# Altium schematic sheet MainSheet.SchDoc
size A; SheetNumber: 2; SheetTotal: 2
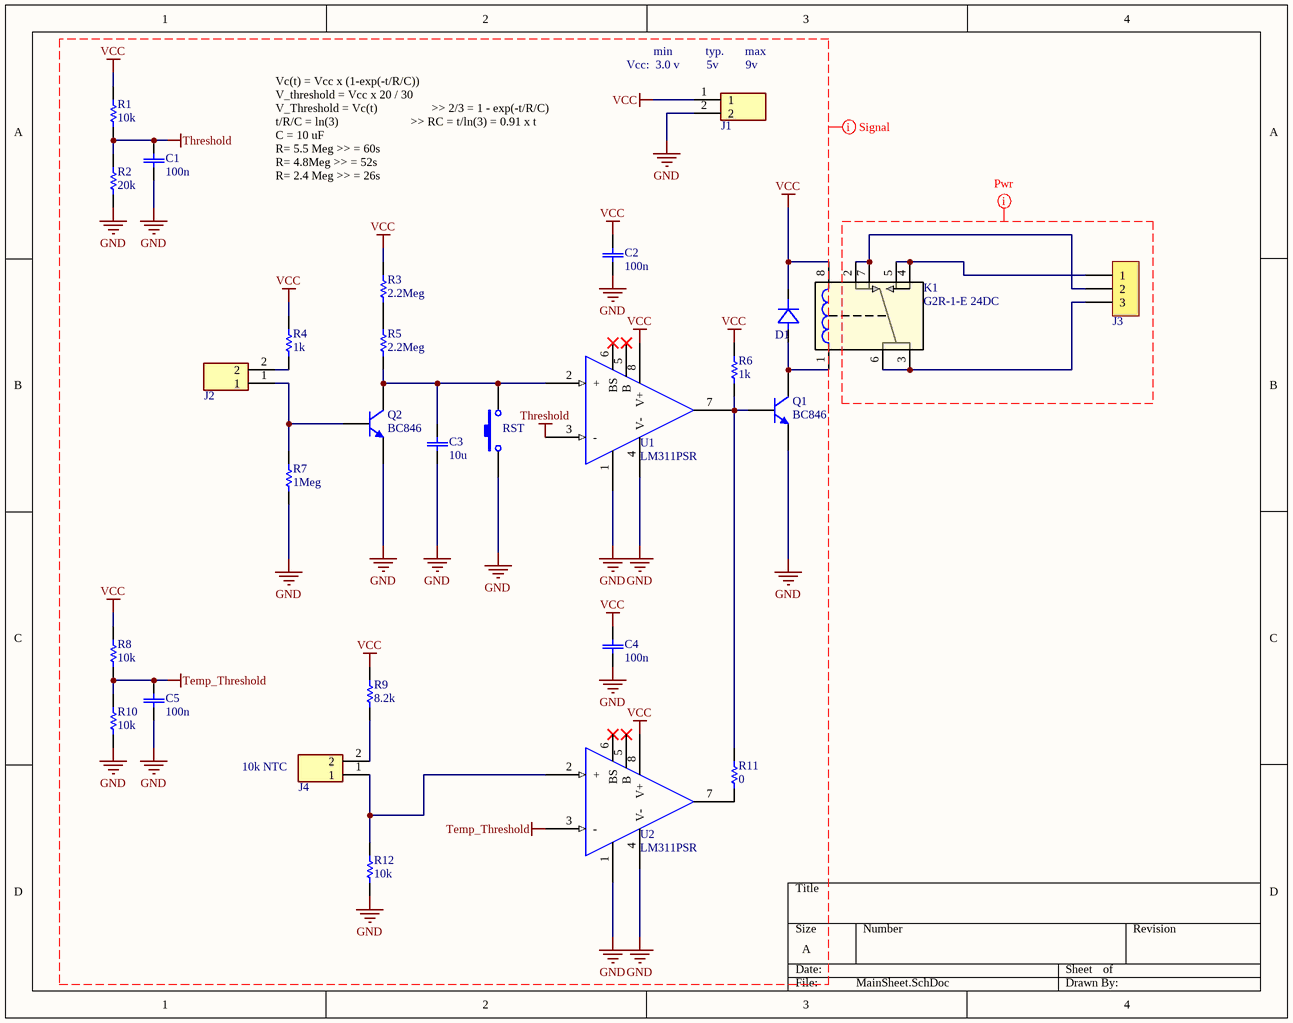
[diagram p0: MainSheet.SchDoc]

## Parts
C1  100n  [CAPC180100_90N_KEM-M]
C2  100n  [CAPC180100_90N_KEM-M]
C3  10u  [CAPC180100_90N_KEM-M]
C4  100n  [CAPC180100_90N_KEM-M]
C5  100n  [CAPC180100_90N_KEM-M]
D1  1N4148WSF-7  [SOD323F_DIO-L]  (value not drawn)
J1  B2B-PH-K-S(LF)(SN)  [JST_B2B-PH-K-S(LF)(SN)]  (value not drawn)
J2  B2B-PH-K-S(LF)(SN)  [JST_B2B-PH-K-S(LF)(SN)]  (value not drawn)
J3  2Pin Terminal  [KF301 2PIN]  (value not drawn)
J4  B2B-PH-K-S(LF)(SN)  [JST_B2B-PH-K-S(LF)(SN)]  (value not drawn)
K1  G2R-1-E 24DC  [RELAY_G2R-1-E_OMR]
Q1  BC846  [SOT23_N]
Q2  BC846  [SOT23_N]
R1  10k  [RESC3413X04N]
R2  20k  [RESC3413X04N]
R3  2.2Meg  [RESC3413X04N]
R4  1k  [RESC3413X04N]
R5  2.2Meg  [RESC3413X04N]
R6  1k  [RESC3413X04N]
R7  1Meg  [RESC3413X04N]
R8  10k  [RESC3413X04N]
R9  8.2k  [RESC3413X04N]
R10  10k  [RESC3413X04N]
R11  0  [RESC3413X04N]
R12  10k  [RESC3413X04N]
RST  Zero  [Switch - Push to On]  (value not drawn)
U1  LM311PSR  [SO-8_STM-L]
U2  LM311PSR  [SO-8_STM-L]

## Nets
GND: C1.1 C2.1 C3.1 C4.1 C5.1 J1.2 Q1.2(E) Q2.2(E) R2.1 R7.2 R10.1 R12.1 RST.1 U1.1(EMITOUT) U1.4(V-) U2.1(EMITOUT) U2.4(V-)
Temp_Threshold: C5.2 R8.1 R10.2 U2.3(-)
Threshold: C1.2 R1.1 R2.2 U1.3(-)
VCC: C2.2 C4.2 D1.1 J1.1 K1.8 R1.2 R3.1 R4.2 R6.2 R8.2 R9.2 U1.8(V+) U2.8(V+)
NetC3_2: C3.2 Q2.3(C) R5.2 RST.2 U1.2(+)
NetD1_2: D1.2 K1.1 Q1.3(C)
NetJ2_1: J2.1 Q2.1(B) R7.1
NetJ2_2: J2.2 R4.1
NetJ3_1: J3.1 K1.4 K1.5
NetJ3_2: J3.2 K1.2 K1.7
NetJ3_3: J3.3 K1.3 K1.6
NetJ4_1: J4.1 R12.2 U2.2(+)
NetJ4_2: J4.2 R9.1
NetQ1_1: Q1.1(B) R6.1 R11.2 U1.7(COLOUT)
NetR3_2: R3.2 R5.1
NetR11_1: R11.1 U2.7(COLOUT)

Not connected (* = marked no-connect by the designer): U1 5(B)* 6(BS)*; U2 5(B)* 6(BS)*

## Layout directives
net class Power: (no net found under the mark)
net class Signal: GND, Temp_Threshold, Threshold, VCC

## Notes on the sheet
- (near J1) Vcc:  3.0 v         5v         9v
- (near J1) min           typ.       max
- Vc(t) = Vcc x (1-exp(-t/R/C))
  V_threshold = Vcc x 20 / 30
  V_Threshold = Vc(t)                  >> 2/3 = 1 - exp(-t/R/C)
  t/R/C = ln(3)                        >> RC = t/ln(3) = 0.91 x t
  C = 10 uF
  R= 5.5 Meg >> = 60s
  R= 4.8Meg >> = 52s
  R= 2.4 Meg >> = 26s
- 10k NTC

## Library data of the parts
C1 C2 C4 C5 = C0603C106M7PACTU: Cap, 100nF, 50v, 0603; Mfr_Name: Kemet; ComponentLink1Description: ickala; ComponentLink1URL: https://ickala.com/cap-smd-0603/11911-c100nf50vs0603.html; footprint: 0603
C3 = C0603C106M7PACTU: Cap 10uF, 50v, 0603; Mfr_Name: Kemet; ComponentLink1Description: ickala; ComponentLink1URL: https://ickala.com/cap-smd-0603/17293-c10uf50vs0603.html; footprint: 0603
D1 = 1N4148WSF-7: No Description Available; Mfr_Name: Diodes Inc; ComponentLink1Description: ickala; ComponentLink1URL: https://ickala.com/standard-diode/39398-1n4148ws.html
J1 J2 J4 = B2B-PH-K-S(LF)(SN): Connector Header Through Hole 2 position 0.079 (2.00mm); MF: JST; SnapEDA_Link: https://www.snapeda.com/parts/B2B-PH-K-S%20(LF)(SN)/JST/view-part/?ref=snap; Package: None; Value: *; MP: B2B-PH-K-S (LF)(SN); Check_prices: https://www.snapeda.com/parts/B2B-PH-K-S%20(LF)(SN)/JST/view-part/?ref=eda
J3 = 3Pin Terminal: Terminal; ComponentLink1Description: ickala; ComponentLink1URL: https://ickala.com/pluggable-terminal/44373-%D8%AA%D8%B1%D9%85%DB%8C%D9%86%D8%A7%D9%84-2-%D9%BE%DB%8C%DA%86.html
K1 = G2R-1-E 24DC: No Description Available; Mfr_Name: Omron; RefDes: RefDes; Type: Type; ComponentLink1Description: ickala; ComponentLink1URL: https://ickala.com/5v-relay/43074-g2r-1-e-5vdc.html
Q1 Q2 = BC846: NPN General-purpose Transistor; PackageReference: SOT23; ComponentLink1Description: Javan; ComponentLink1URL: https://www.javanelec.com/Shops?productCategory=884#dtl/7151; ComponentLink2Description: Paya; ComponentLink2URL: available; ComponentLink3Description: ickala; ComponentLink3URL: https://ickala.com/bjt-parts/12141-bc846b.html?search_query=BC846&results=1
R1 R8 R10 R12 = RES 0805 0.125W: Res 10k, 5%,  0805; Desc.: RES SMD 0805; ComponentLink1Description: ickala; ComponentLink1URL: https://ickala.com/r0805-5/12395-r10k-0805-5.html
R2 = RES 0805 0.125W: Res 20k, 5%, 0805; Desc.: RES SMD 0805; ComponentLink1Description: ickala; ComponentLink1URL: https://ickala.com/r0805-5/14277-r20k-0805-5.html
R3-R6 R11 = RES 0805 0.125W: RES 0805; Desc.: RES SMD 0805
  R3 R5: ComponentLink1Description: ic kala; ComponentLink1URL: https://ickala.com/r0805-5/14271-r22m-0805-5.html; footprint: 0805
  R4 R6: ComponentLink1Description: Javan; ComponentLink1URL: https://www.javanelec.com/Shops?searchFilter=BC856#dtl/3997
  R11: ComponentLink1Description: Javan
R7 = RES 0805 0.125W: Res 1Meg, 5%, 0805; Desc.: RES SMD 0805; ComponentLink1Description: ickala; ComponentLink1URL: https://ickala.com/r0805-5/14268-r1m-0805-5.html; footprint: 0803
R9 = RES 0805 0.125W: Res 8.2k, 5%,  0805; Desc.: RES SMD 0805; ComponentLink1Description: ickala; ComponentLink1URL: https://ickala.com/r0805-5/14349-r82k-0805-5.html
RST = Switch PB: Push Button Switch
U1 U2 = LM311PSR: No Description Available; Mfr_Name: Texas Instruments; RefDes: RefDes; Type: Type; ComponentLink1Description: ic kala; ComponentLink1URL: https://ickala.com/ic-comarators/24740-lm311dr.html